# EAGLE design charlieplex12 (EAGLE 9.0.0)
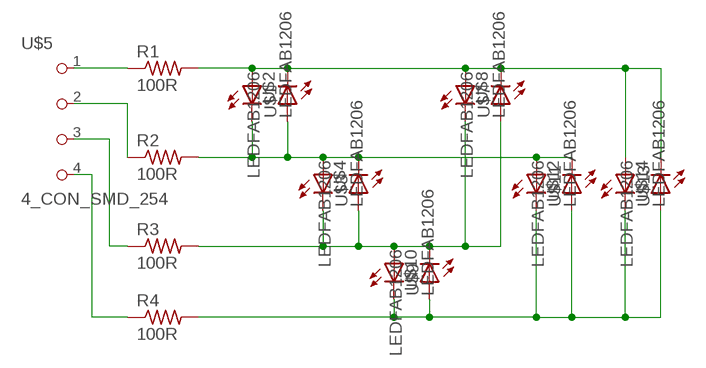
[diagram p0: schematic, sheet 1]

## Parts
R1  100R  RES-US1206FAB  [R1206FAB]
R2  100R  RES-US1206FAB  [R1206FAB]
R3  100R  RES-US1206FAB  [R1206FAB]
R4  100R  RES-US1206FAB  [R1206FAB]
U$1  LEDFAB1206  [LED1206FAB]
U$2  LEDFAB1206  [LED1206FAB]
U$3  LEDFAB1206  [LED1206FAB]
U$4  LEDFAB1206  [LED1206FAB]
U$5  4_CON_SMD_254  [4_CON_SMD_254]
U$7  LEDFAB1206  [LED1206FAB]
U$8  LEDFAB1206  [LED1206FAB]
U$9  LEDFAB1206  [LED1206FAB]
U$10  LEDFAB1206  [LED1206FAB]
U$11  LEDFAB1206  [LED1206FAB]
U$12  LEDFAB1206  [LED1206FAB]
U$13  LEDFAB1206  [LED1206FAB]
U$14  LEDFAB1206  [LED1206FAB]

## Nets
N$1: R1.2 U$1.1(A) U$2.2(C) U$7.1(A) U$8.2(C) U$13.1(A) U$14.2(C)
N$2: R2.2 U$1.2(C) U$2.1(A) U$3.1(A) U$4.2(C) U$11.1(A) U$12.2(C)
N$3: R3.2 U$3.2(C) U$4.1(A) U$7.2(C) U$8.1(A) U$9.1(A) U$10.2(C)
N$4: R4.2 U$9.2(C) U$10.1(A) U$11.2(C) U$12.1(A) U$13.2(C) U$14.1(A)
N$5: R1.1 U$5.1
N$6: R2.1 U$5.2
N$7: R3.1 U$5.3
N$8: R4.1 U$5.4

## Library data of the parts
R1-R4 = fab:RES-US: Resistor (US Symbol) Variants with postfix FAB are widened to allow the routing of internal traces
U$1-U$4 U$7-U$14 = fab:LED: LED
U$5 = solidlib:4_CON_SMD_254

## Board
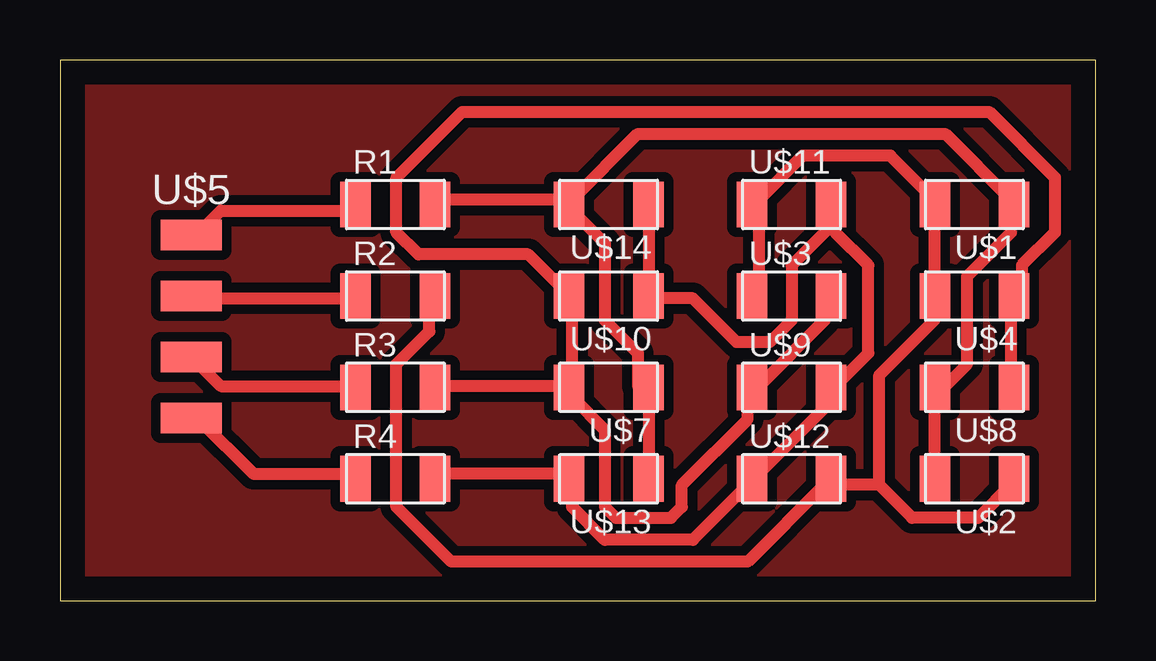
[diagram p1: board, top side]

Size 43.16 x 22.53 mm. Coordinates in mm from the lower left corner, seen from the top.
Outline: 0,0 43.16,0 43.16,22.53 0,22.53 0,0
Copper layers (1*16): Top 0.035mm / dielectric 1.5mm / Bottom 0.035mm
Design rules "default *": minimum track width 20mil, minimum drill 0.35mm, track to track 16mil, track to pad 16mil, pad to pad 16mil, via to via 6mil, smd to smd 16mil, copper to edge 40mil, drill to drill 6mil, minimum pad ring 10mil, minimum via ring 8mil, stop-mask expansion 4mil, vias tented up to drill 0mil, thermal gap 10mil

### Footprints (pad centres in the part's own frame; a part is rotated, then mirrored left to right if it is on the bottom)
R1206FAB = smd 1.27 x 1.905: 1 -1.651,0; 2 1.651,0
LED1206FAB = smd 1.27 x 1.905: 1 -1.651,0; 2 1.651,0
4_CON_SMD_254 = smd 2.54 x 1.27: 1 0.38,2.54; 2 0.38,0; 3 0.38,-2.54; 4 0.38,-5.08

### Placement (x,y rotation side)
R1  13.97,16.51 0 top
R2  13.97,12.7 0 top
R3  13.97,8.89 0 top
R4  13.97,5.08 0 top
U$1  38.1,16.51 180 top
U$2  38.1,5.08 180 top
U$3  30.48,12.7 0 top
U$4  38.1,12.7 180 top
U$5  5.08,12.7 0 top
U$7  22.86,8.89 180 top
U$8  38.1,8.89 180 top
U$9  30.48,8.89 0 top
U$10  22.86,12.7 180 top
U$11  30.48,16.51 0 top
U$12  30.48,5.08 0 top
U$13  22.86,5.08 180 top
U$14  22.86,16.51 180 top

### Tracks (layer width: path | path; a pad name or v marks a point on that pad's centre or on a via)
N$1
  Top 0.508: U$2.2 36.42,5.28 36.42,8.48 U$8.2 36.88,8.94 37.8,9.86 37.8,13.51 39.62,15.34 39.62,16.26 U$1.1 39.62,16.71 36.88,19.46 24.08,19.46 21.34,16.71 U$14.2 | U$13.1 24.54,5.28 24.54,8.48 U$7.1 24.08,8.94 24.08,10.31 22.71,11.68 22.71,14.88 21.34,16.26 U$14.2 | R1.2 15.85,16.71 20.88,16.71 U$14.2
N$2
  Top 0.508: U$3.1 29.11,13.06 29.11,16.26 U$11.1 29.11,16.71 30.94,18.54 34.59,18.54 36.42,16.71 U$1.2 36.42,16.26 36.42,13.06 U$4.2 36.42,12.6 36.42,11.68 34.14,9.4 34.14,4.83 | 34.14,4.83 32.31,4.83 U$12.2 31.85,4.83 28.65,1.63 16.31,1.63 14.02,3.91 14.02,9.86 15.39,11.23 15.39,12.6 R2.2 | 34.14,4.83 35.51,3.45 38.25,3.45 39.62,4.83 U$2.1
N$3
  Top 0.508: U$3.2 31.85,12.6 31.85,11.68 29.11,8.94 U$9.1 28.65,8.48 28.65,7.57 25.91,4.83 25.91,3.91 25.45,3.45 23.16,3.45 22.71,3.91 22.71,7.11 21.34,8.48 U$7.2 | U$8.1 39.62,8.94 39.62,12.6 U$4.1 40.08,13.06 40.08,13.97 41.45,15.34 41.45,17.63 38.71,20.37 16.76,20.37 14.02,17.63 14.02,15.34 14.94,14.43 19.51,14.43 20.88,13.06 U$10.2 21.34,12.6 21.34,8.94 U$7.2 | R3.2 15.85,8.94 20.88,8.94 U$7.2
N$4
  Top 0.508: R4.2 15.85,5.28 20.88,5.28 U$13.2 21.34,4.83 21.34,3.91 22.71,2.54 26.36,2.54 28.65,4.83 U$12.1 29.11,5.28 32.31,8.48 U$9.2 32.31,8.94 33.68,10.31 33.68,13.97 32.31,15.34 32.31,15.8 | U$14.1 24.54,16.26 24.54,13.06 U$10.1 24.54,12.6 26.36,12.6 28.19,10.77 29.57,10.77 30.48,11.68 30.48,13.97 32.31,15.8 | 32.31,15.8 32.31,16.26 U$11.2 32.31,15.8
N$5
  Top 0.508: R1.1 12.19,16.26 6.71,16.26 5.79,15.34 U$5.1
N$6
  Top 0.508: R2.1 12.19,12.6 5.79,12.6 U$5.2
N$7
  Top 0.508: R3.1 12.19,8.94 6.71,8.94 5.79,9.86 U$5.3
N$8
  Top 0.508: R4.1 12.19,5.28 8.08,5.28 5.79,7.57 U$5.4
N$9
  pour Top: 0,22.86 43.18,22.86 43.18,0 0,0